# EAGLE design ESPOAT (EAGLE 9.6.2)
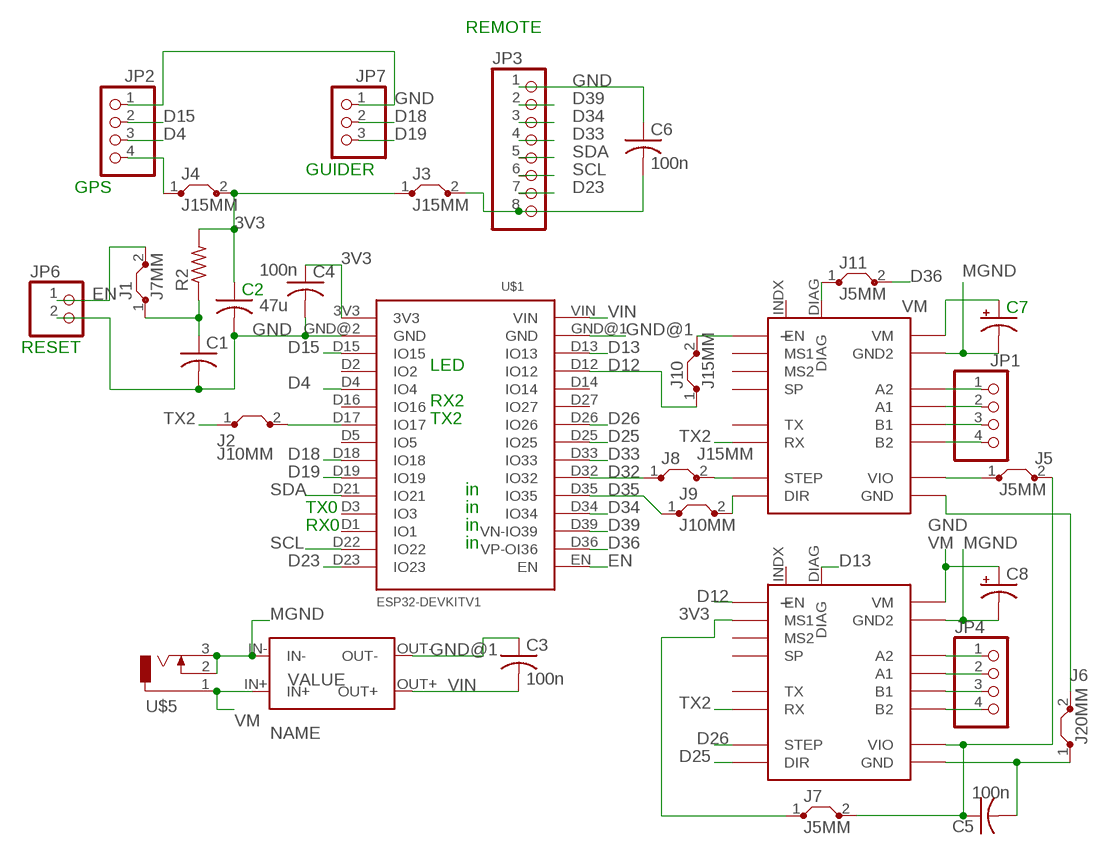
[diagram p0: schematic, sheet 1]

## Parts
C1  C-US025-030X050  [C025-030X050]
C2  47u  C-US050-024X044  [C050-024X044]
C3  100n  C-US050-024X044  [C050-024X044]
C4  100n  C-US050-024X044  [C050-024X044]
C5  100n  C-US050-024X044  [C050-024X044]
C6  100n  C-US050-024X044  [C050-024X044]
C7  CPOL-USE5-8.5  [E5-8,5]
C8  CPOL-USE5-8.5  [E5-8,5]
J1  J7MM  [07]
J2  J10MM  [10]
J3  J15MM  [15]
J4  J15MM  [15]
J5  J5MM  [05]
J6  J20MM  [20]
J7  J5MM  [05]
J8  J15MM  [15]
J9  J10MM  [10]
J10  J15MM  [15]
J11  J5MM  [05]
JP1  PINHD-1X4  [1X04]
JP2  PINHD-1X4  [1X04]
JP3  PINHD-1X8  [1X08]
JP4  PINHD-1X4  [1X04]
JP6  PINHD-1X2  [1X02]
JP7  PINHD-1X3  [1X03]
R2  R-US_0207/10  [0207/10]
U$1  ESP32DEVKITV1  [ESP32-DEVKITV1]
U$2  FY2209V3  [FY2209V3]
U$3  FY2209V3  [FY2209V3]
U$4  MINI-360  [MINI-360]
U$5  PS0520  [DCJ0203]

## Nets
3V3: C2.1 C4.1 J3.1 J4.2 J7.1 R2.2 U$1.3V3 U$3.MS1
D4: JP2.3 U$1.D4(IO4)
D12: J10.1 U$1.D12(IO12) U$3.EN
D13: U$1.D13(IO13) U$3.DIAG
D15: JP2.2 U$1.D15(IO15)
D18: JP7.2 U$1.D18(IO18)
D19: JP7.3 U$1.D19(IO19)
D23: JP3.7 U$1.D23(IO23)
D25: U$1.D25(IO25) U$3.DIR
D26: U$1.D26(IO26) U$3.STP(STEP)
D32: J8.1 U$1.D32(IO32)
D33: JP3.4 U$1.D33(IO33)
D34: JP3.3 U$1.D34(IO34)
D35: J9.1 U$1.D35(IO35)
D36: J11.2 U$1.D36(VP-OI36)
D39: JP3.2 U$1.D39(VN-IO39)
EN: J1.2 JP6.1 U$1.EN
GND: C1.2 C2.2 C4.2 C6.1 J6.2 JP2.1 JP3.1 JP6.2 JP7.1 U$1.GND@2(GND) U$2.GND
GND@1: C3.1 U$1.GND@1(GND) U$4.OUT-
MGND: C7.- C8.- U$2.GND2 U$3.GND2 U$4.IN- U$5.2 U$5.3
N$1: JP1.4 U$2.B2
N$3: J8.2 U$2.STP(STEP)
N$4: C1.1 J1.1 R2.1
N$5: J2.2 U$1.D17(IO17)
N$6: JP1.3 U$2.B1
N$7: C5.1 J5.2 J7.2 U$3.VIO
N$8: J4.1 JP2.4
N$9: J5.1 U$2.VIO
N$10: C5.2 J6.1 U$3.GND
N$11: J9.2 U$2.DIR
N$12: J10.2 U$2.EN
N$13: JP1.2 U$2.A1
N$14: JP1.1 U$2.A2
N$15: JP4.1 U$3.A2
N$16: JP4.2 U$3.A1
N$17: JP4.3 U$3.B1
N$18: JP4.4 U$3.B2
N$19: J11.1 U$2.DIAG
N$20: C6.2 J3.2 JP3.8
SCL: JP3.6 U$1.D22(IO22)
SDA: JP3.5 U$1.D21(IO21)
TX2: J2.1 U$2.RX U$3.RX
VIN: C3.2 U$1.VIN U$4.OUT+
VM: C7.+ C8.+ U$2.VM U$3.VM U$4.IN+ U$5.1
Unconnected: U$1.D1(IO1) U$1.D2(IO2) U$1.D3(IO3) U$1.D5(IO5) U$1.D14(IO14) U$1.D16(IO16) U$1.D27(IO27) U$2.INDX(I) U$2.MS1 U$2.MS2 U$2.SP U$2.TX U$3.INDX(I) U$3.MS2 U$3.SP U$3.TX

## Notes on the sheet
- REMOTE
- GUIDER
- GPS
- RESET
- LED
- RX2
- TX2
- in
- TX0 | in
- RX0 | in
- in

## Library data of the parts
C1-C6 = rcl:C-US: CAPACITOR, American symbol; SPICEPREFIX: C
C7 C8 = rcl:CPOL-US: POLARIZED CAPACITOR, American symbol; SPICEPREFIX: C
J1-J11 = jumper:J: Bridge
JP1 JP2 JP4 = pinhead:PINHD-1X4: PIN HEADER
JP3 = pinhead:PINHD-1X8: PIN HEADER
JP6 = pinhead:PINHD-1X2: PIN HEADER
JP7 = pinhead:PINHD-1X3: PIN HEADER
R2 = rcl:R-US_: RESISTOR, American symbol; SPICEPREFIX: R
U$1 = ESP32-DEVKITV1:ESP32DEVKITV1
U$2 U$3 = jlg:FY2209V3
U$4 = jlg:MINI-360
U$5 = jlg:PS0520: Jaycar PS0520 DC power jack

## Board
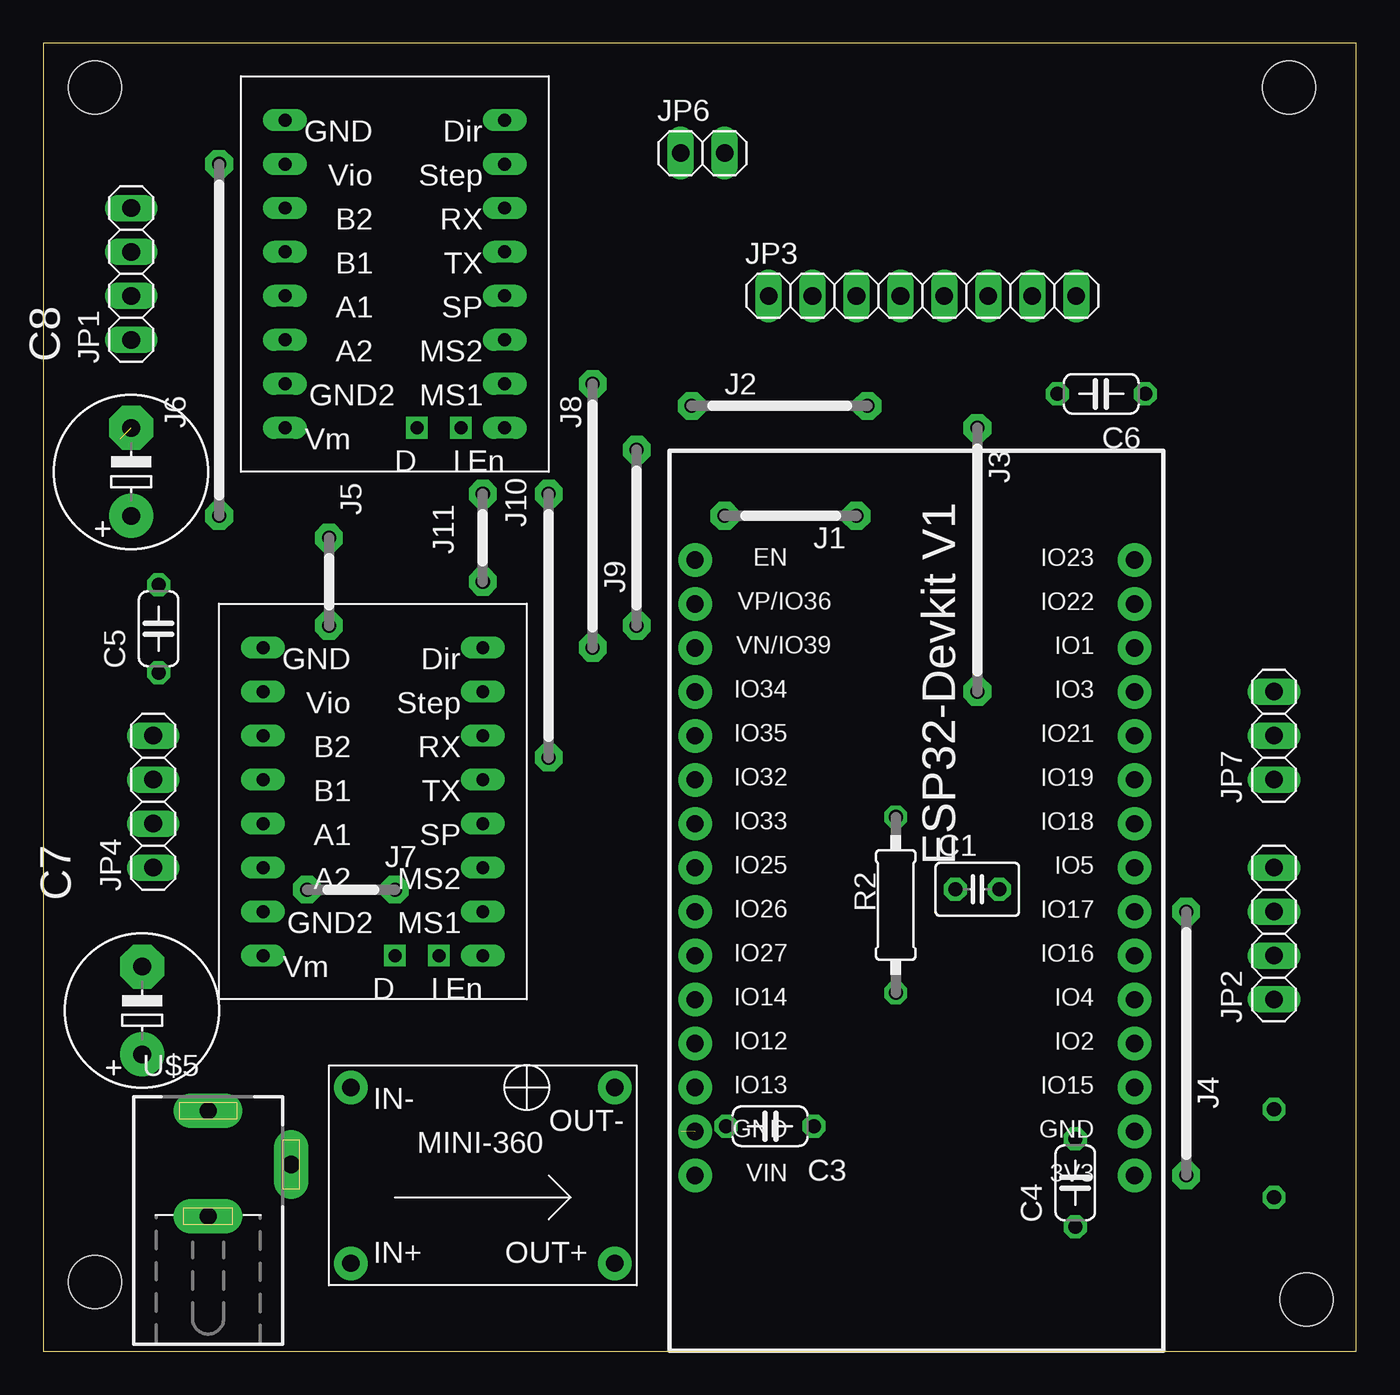
[diagram p1: board, top side]
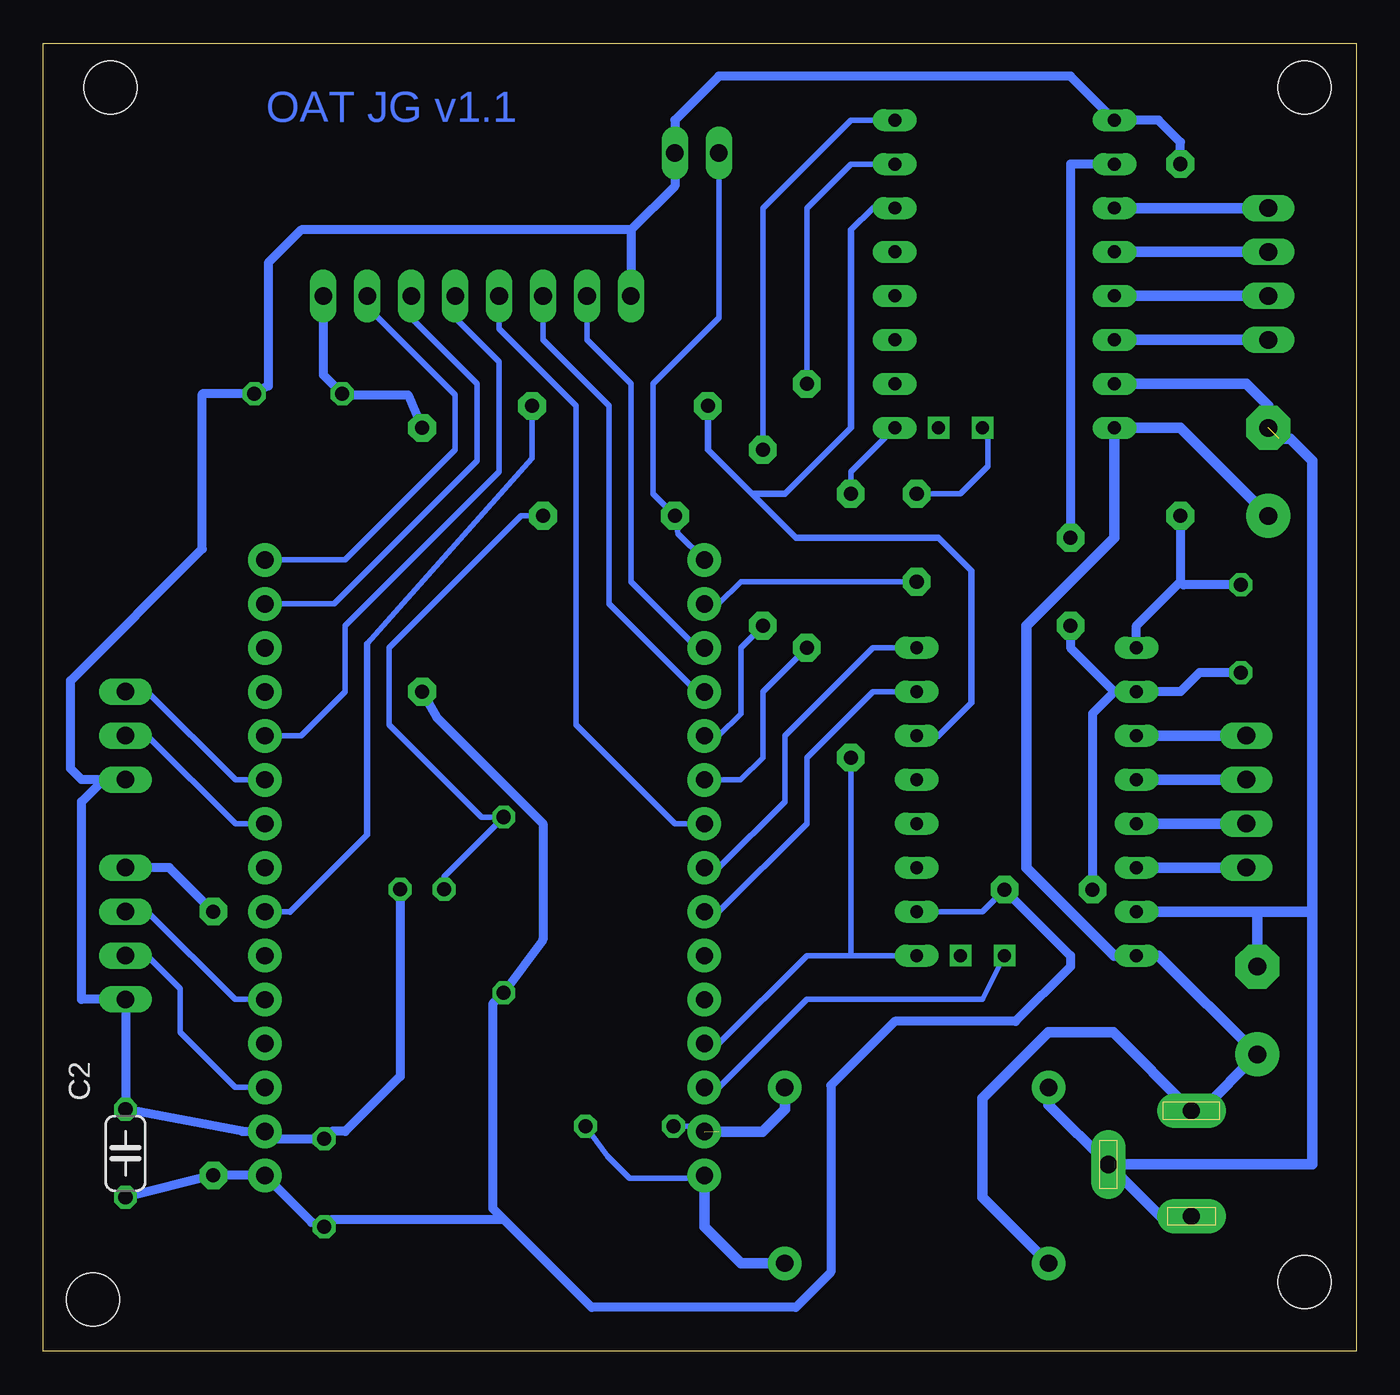
[diagram p2: board, bottom side, seen from below]

Size 75.87 x 75.56 mm. Coordinates in mm from the lower left corner, seen from the top.
Outline: 0,0 75.87,0 75.87,75.56 0,75.56 0,0
Copper layers (1*16): Top 0.035mm / dielectric 1.5mm / Bottom 0.035mm
Design rules "mill": minimum track width 15mil, minimum drill 24mil, track to track 16mil, track to pad 16mil, pad to pad 16mil, via to via 16mil, smd to smd 6mil, copper to edge 40mil, drill to drill 6mil, minimum pad ring 10mil, minimum via ring 8mil, stop-mask expansion 4mil, vias tented up to drill 0mil, thermal gap 10mil
Holes 3.05 mm at 73,3 72,73 3,73 3,4

### Footprints (pad centres in the part's own frame; a part is rotated, then mirrored left to right if it is on the bottom)
C025-030X050 = drill 0.813 octagon: 1 -1.27,0; 2 1.27,0
C050-024X044 = drill 0.813 octagon: 1 -2.54,0; 2 2.54,0
E5-8,5 = drill 1.016 pad 2.54: + -2.54,0 | drill 1.016 pad 2.54 octagon: - 2.54,0
07 = drill 0.813 pad 1.6 octagon: 1 -3.81,0; 2 3.81,0
10 = drill 0.813 pad 1.6 octagon: 1 -5.08,0; 2 5.08,0
15 = drill 0.813 pad 1.6 octagon: 1 -7.62,0; 2 7.62,0
05 = drill 0.813 pad 1.6 octagon: 1 -2.54,0; 2 2.54,0
20 = drill 0.813 pad 1.6 octagon: 1 -10.16,0; 2 10.16,0
1X04 = drill 1.016 long: 1 -3.81,0; 2 -1.27,0; 3 1.27,0; 4 3.81,0
1X08 = drill 1.016 long: 1 -8.89,0; 2 -6.35,0; 3 -3.81,0; 4 -1.27,0; 5 1.27,0; 6 3.81,0; 7 6.35,0; 8 8.89,0
1X02 = drill 1.016 long: 1 -1.27,0; 2 1.27,0
1X03 = drill 1.016 long: 1 -2.54,0; 2 0,0; 3 2.54,0
0207/10 = drill 0.813 octagon: 1 -5.08,0; 2 5.08,0
ESP32-DEVKITV1 = drill 1 pad 1.93: 3V3 -16.52,-12.27; D1 13.96,-12.27; D2 -8.9,-12.27; D3 11.42,-12.27; D4 -6.36,-12.27; D5 1.26,-12.27; D12 -8.9,13.135; D13 -11.44,13.135; D14 -6.36,13.135; D15 -11.44,-12.27; D16 -3.82,-12.27; D17 -1.28,-12.27; D18 3.8,-12.27; D19 6.34,-12.27; D21 8.88,-12.27; D22 16.5,-12.27; D23 19.04,-12.27; D25 1.26,13.135; D26 -1.28,13.135; D27 -3.82,13.135; D32 6.34,13.135; D33 3.8,13.135; D34 11.42,13.135; D35 8.88,13.135; D36 16.5,13.135; D39 13.96,13.135; EN 19.04,13.135; GND@1 -13.98,13.135; GND@2 -13.98,-12.27; VIN -16.52,13.135
FY2209V3 = drill 0.75 long: A1 6.35,1.27; A2 6.35,3.81; B1 6.35,-1.27; B2 6.35,-3.81; EN -6.35,8.89; GND 6.35,-8.89; GND2 6.35,6.35; MS1 -6.35,6.35; MS2 -6.35,3.81; RX -6.35,-3.81; SP -6.35,1.27; TX -6.35,-1.27; VIO 6.35,-6.35; VM 6.35,8.89 | drill 0.75 square: DIAG -1.27,8.89; INDX -3.81,8.89 | drill 0.75 pad 1.27 long: DIR -6.35,-8.89; STP -6.35,-6.35
MINI-360 = drill 1 pad 1.93: IN+ -7.62,-5.08; IN- -7.62,5.08; OUT+ 7.62,-5.08; OUT- 7.62,5.08
DCJ0203 = drill 1 pad 2 long: 1 0,3.1; 2 4.8,0; 3 0,-3

### Placement (x,y rotation side)
C1  53.98,26.68 0 top
C2  71.12,11.43 90 bottom
C3  42,13 0 top
C4  59.63,9.73 90 top
C5  6.67,41.73 90 top
C6  61.13,55.3 180 top
C7  5.71,19.68 90 top
C8  5.08,50.8 90 top
J1  43.18,48.26 180 top
J2  42.55,54.61 0 top
J3  53.98,45.72 90 top
J4  66.04,17.78 270 top
J5  16.51,44.45 270 top
J6  10.16,58.42 90 top
J7  17.78,26.67 180 top
J8  31.75,48.26 90 top
J9  34.29,46.99 90 top
J10  29.21,41.91 90 top
J11  25.4,46.99 270 top
JP1  5.08,62.23 90 top
JP2  71.12,24.13 90 top
JP3  50.8,60.96 0 top
JP4  6.35,31.75 90 top
JP6  38.1,69.22 0 top
JP7  71.12,35.56 90 top
R2  49.26,25.78 270 top
U$1  50.8,26.67 90 top
U$2  20.32,62.23 180 top
U$3  19.05,31.75 180 top
U$4  25.4,10.16 0 top
U$5  9.53,10.79 0 top

### Tracks (layer width: path | path; a pad name or v marks a point on that pad's centre or on a via)
3V3
  Bottom 0.152: U$1.3V3
  Bottom 0.305: J7.1 21.59,25.4 U$3.MS1
  Bottom 0.508: J3.1 53.13,36.62 46.99,30.48 46.99,23.78 R2.2 49.9,20.07 49.9,8.26 49.26,7.62 | C2.1 J4.2 U$1.3V3 60.36,7.44 C4.1 59.2,7.62 49.26,7.62 | J7.1 16.51,22.86 16.51,22.23 19.68,19.05 26.67,19.05 30.36,15.36 30.36,4.57 32.38,2.54 44.18,2.54 49.26,7.62
D4
  Bottom 0.152: U$1.D4
  Bottom 0.305: U$1.D4 64.77,20.32 69.85,25.4 JP2.3
D12
  Bottom 0.305: U$1.D12 36.84,17.77 31.75,22.86 29.21,22.86 | U$3.EN 29.21,22.86 | J10.1 29.21,22.86
D13
  Bottom 0.305: U$1.D13 36.84,15.23 31.75,20.32 21.59,20.32 U$3.DIAG
D15
  Bottom 0.152: U$1.D15
  Bottom 0.305: U$1.D15 64.77,15.24 67.94,18.41 67.94,20.95 69.85,22.86 JP2.2
D18
  Bottom 0.305: U$1.D18 64.76,30.47 69.85,35.56 JP7.2
D19
  Bottom 0.305: U$1.D19 64.76,33.01 69.85,38.1 JP7.3
D23
  Bottom 0.305: JP3.7 57.15,60.33 52.07,55.24 52.07,52.07 58.43,45.71 U$1.D23
D25
  Bottom 0.305: U$3.DIR 27.94,40.64 33.02,35.56 33.02,31.75 36.84,27.93 U$1.D25
D26
  Bottom 0.305: U$3.STP 27.94,38.1 31.75,34.29 31.75,30.48 36.84,25.39 U$1.D26
D32
  Bottom 0.305: J8.1 34.29,38.1 34.29,34.29 35.57,33.01 U$1.D32
D33
  Bottom 0.305: JP3.4 49.53,59.05 45.09,54.61 45.09,36.2 39.36,30.47 U$1.D33
D34
  Bottom 0.305: U$1.D34 38.09,38.09 43.18,43.18 43.18,54.61 46.99,58.42 JP3.3
D35
  Bottom 0.305: J9.1 35.56,40.64 35.56,36.83 36.84,35.55 U$1.D35
D36
  Bottom 0.305: J11.2 35.56,44.45 36.84,43.17 U$1.D36
D39
  Bottom 0.305: U$1.D39 38.09,40.63 41.91,44.45 41.91,55.88 44.45,58.42 JP3.2
EN
  Bottom 0.305: JP6.1 36.83,59.69 40.64,55.88 40.64,49.53 J1.2 39.19,47.24 U$1.EN
GND
  Bottom 0.152: JP7.1 72.39,33.02 | 62.88,12.88 U$1.GND@2
  Bottom 0.305: 62.73,12.73 62.88,12.88
  Bottom 0.508: 41.91,64.77 39.37,67.31 JP6.2 39.37,71.12 36.83,73.66 16.51,73.66 U$2.GND 11.43,71.12 10.16,69.85 J6.2 | 72.39,33.02 73.66,31.75 73.66,20.32 JP2.1 C2.2 64.35,12.7 64.34,12.69 U$1.GND@2 62.65,12.27 C4.2 59.2,12.7 58.42,12.7 55.24,15.88 C1.2 | JP7.1 73.66,33.02 74.3,33.66 74.3,38.73 66.67,46.35 66.67,55.3 C6.1 62.87,55.77 62.87,62.87 60.96,64.77 41.91,64.77 | 41.91,64.77 JP3.1
GND@1  (1 unrouted)
  Bottom 0.152: 36.83,12.7 36.84,12.69
  Bottom 0.305: C3.1 37.98,13 U$1.GND@1
  Bottom 0.61: U$4.OUT- 33.02,13.97 34.3,12.69 U$1.GND@1
MGND  (1 unrouted)
  Bottom 0.61: U$5.2 2.54,10.79 2.54,25.4 | 2.54,25.4 5.71,25.4 | 5.71,25.4 U$3.GND2 | 2.54,25.4 2.54,51.44 3.81,52.7 4.45,52.7 | U$5.3 11.32,7.79 U$5.2 | U$4.IN- 17.78,14.25 U$5.2 | U$2.GND2 6.35,55.88 5.08,54.61 C8.- | 5.71,25.4 C7.-
N$1
  Bottom 0.61: U$2.B2 JP1.4
N$3
  Bottom 0.305: U$2.STP 29.21,68.58 31.75,66.04 J8.2
N$4
  Bottom 0.305: C1.1 52.7,27.41 R2.1 50.55,30.86 55.88,36.2 55.88,40.64 48.26,48.26 J1.1
N$5
  Bottom 0.152: U$1.D17
  Bottom 0.305: 61.59,25.4 U$1.D17 | J2.2 47.62,51.59 57.15,40.88
  Bottom 0.381: 57.15,40.88 57.15,29.84 61.59,25.4
N$6
  Bottom 0.61: U$2.B1 7.62,63.5 JP1.3
N$7
  Bottom 0.508: 13.97,38.1 U$3.VIO 10.16,38.1 9.06,39.2 C5.1 | 13.97,38.1 15.24,36.83 J7.2 | J5.2 16.51,40.64 13.97,38.1
N$8
  Bottom 0.508: J4.1 68.58,27.94 JP2.4
N$9
  Bottom 0.508: U$2.VIO 16.51,68.58 J5.1
N$10
  Bottom 0.508: U$3.GND 12.7,41.91 10.16,44.45 | J6.1 10.16,44.45 | C5.2 9.98,44.27 10.16,44.45
N$11
  Bottom 0.305: U$2.DIR 29.21,71.12 34.29,66.04 J9.2
N$12
  Bottom 0.305: U$2.EN 29.21,50.8 J10.2
N$13
  Bottom 0.61: U$2.A1 JP1.2
N$14
  Bottom 0.61: U$2.A2 JP1.1
N$15
  Bottom 0.61: JP4.1 U$3.A2
N$16
  Bottom 0.61: JP4.2 U$3.A1
N$17
  Bottom 0.61: JP4.3 U$3.B1
N$18
  Bottom 0.61: JP4.4 U$3.B2
N$19
  Bottom 0.305: U$2.DIAG 21.27,53.02 21.27,51.12 22.86,49.53 J11.1
N$20
  Bottom 0.508: 59.87,60.78 JP3.8 59.69,56.4 C6.2 58.53,55.24 54.79,55.24 J3.2
SCL
  Bottom 0.305: U$1.D22 59.06,43.17 50.8,51.44 50.8,55.88 54.61,59.69 JP3.6
SDA
  Bottom 0.152: 63.5,35.56 63.49,35.55 U$1.D21
  Bottom 0.305: 63.5,35.56 60.96,35.56 58.42,38.1 58.42,41.91 49.53,50.8 49.53,57.15 52.07,59.69 JP3.5
TX2
  Bottom 0.381: 34.92,49.53 33.02,49.53 29.21,53.34 29.21,64.77 27.94,66.04 U$2.RX | 34.92,49.53 37.47,52.07 J2.1 | 34.92,49.53 32.38,46.99 24.13,46.99 22.23,45.09 22.23,37.47 24.13,35.56 U$3.RX
VIN
  Bottom 0.305: U$1.VIN 37.81,10 42,10 43.27,11.27 C3.2
  Bottom 0.61: U$4.OUT+ 35.56,5.08 37.66,7.18 U$1.VIN
VM
  Bottom 0.61: U$4.IN+ 21.59,8.89 21.59,14.61 17.78,18.41 14.04,18.41 U$5.1 8.96,13.89 C7.+ 11.43,22.86 U$3.VM 13.97,22.86 19.05,27.94 19.05,41.91 13.97,46.99 U$2.VM 10.16,53.34 C8.+

### Text on the board
Bottom: OAT JG v1.1